# EasyEDA schematic SCH_【Umeko-DEC-H】海曼htpa性价比口袋热成像仪_2025-03-20 (1).json
TITLE: Sheet_1; REV: 1.0; Date: 2025-01-16; Sheet: 1/1; Drawn By: umekoko; Company: Your Company
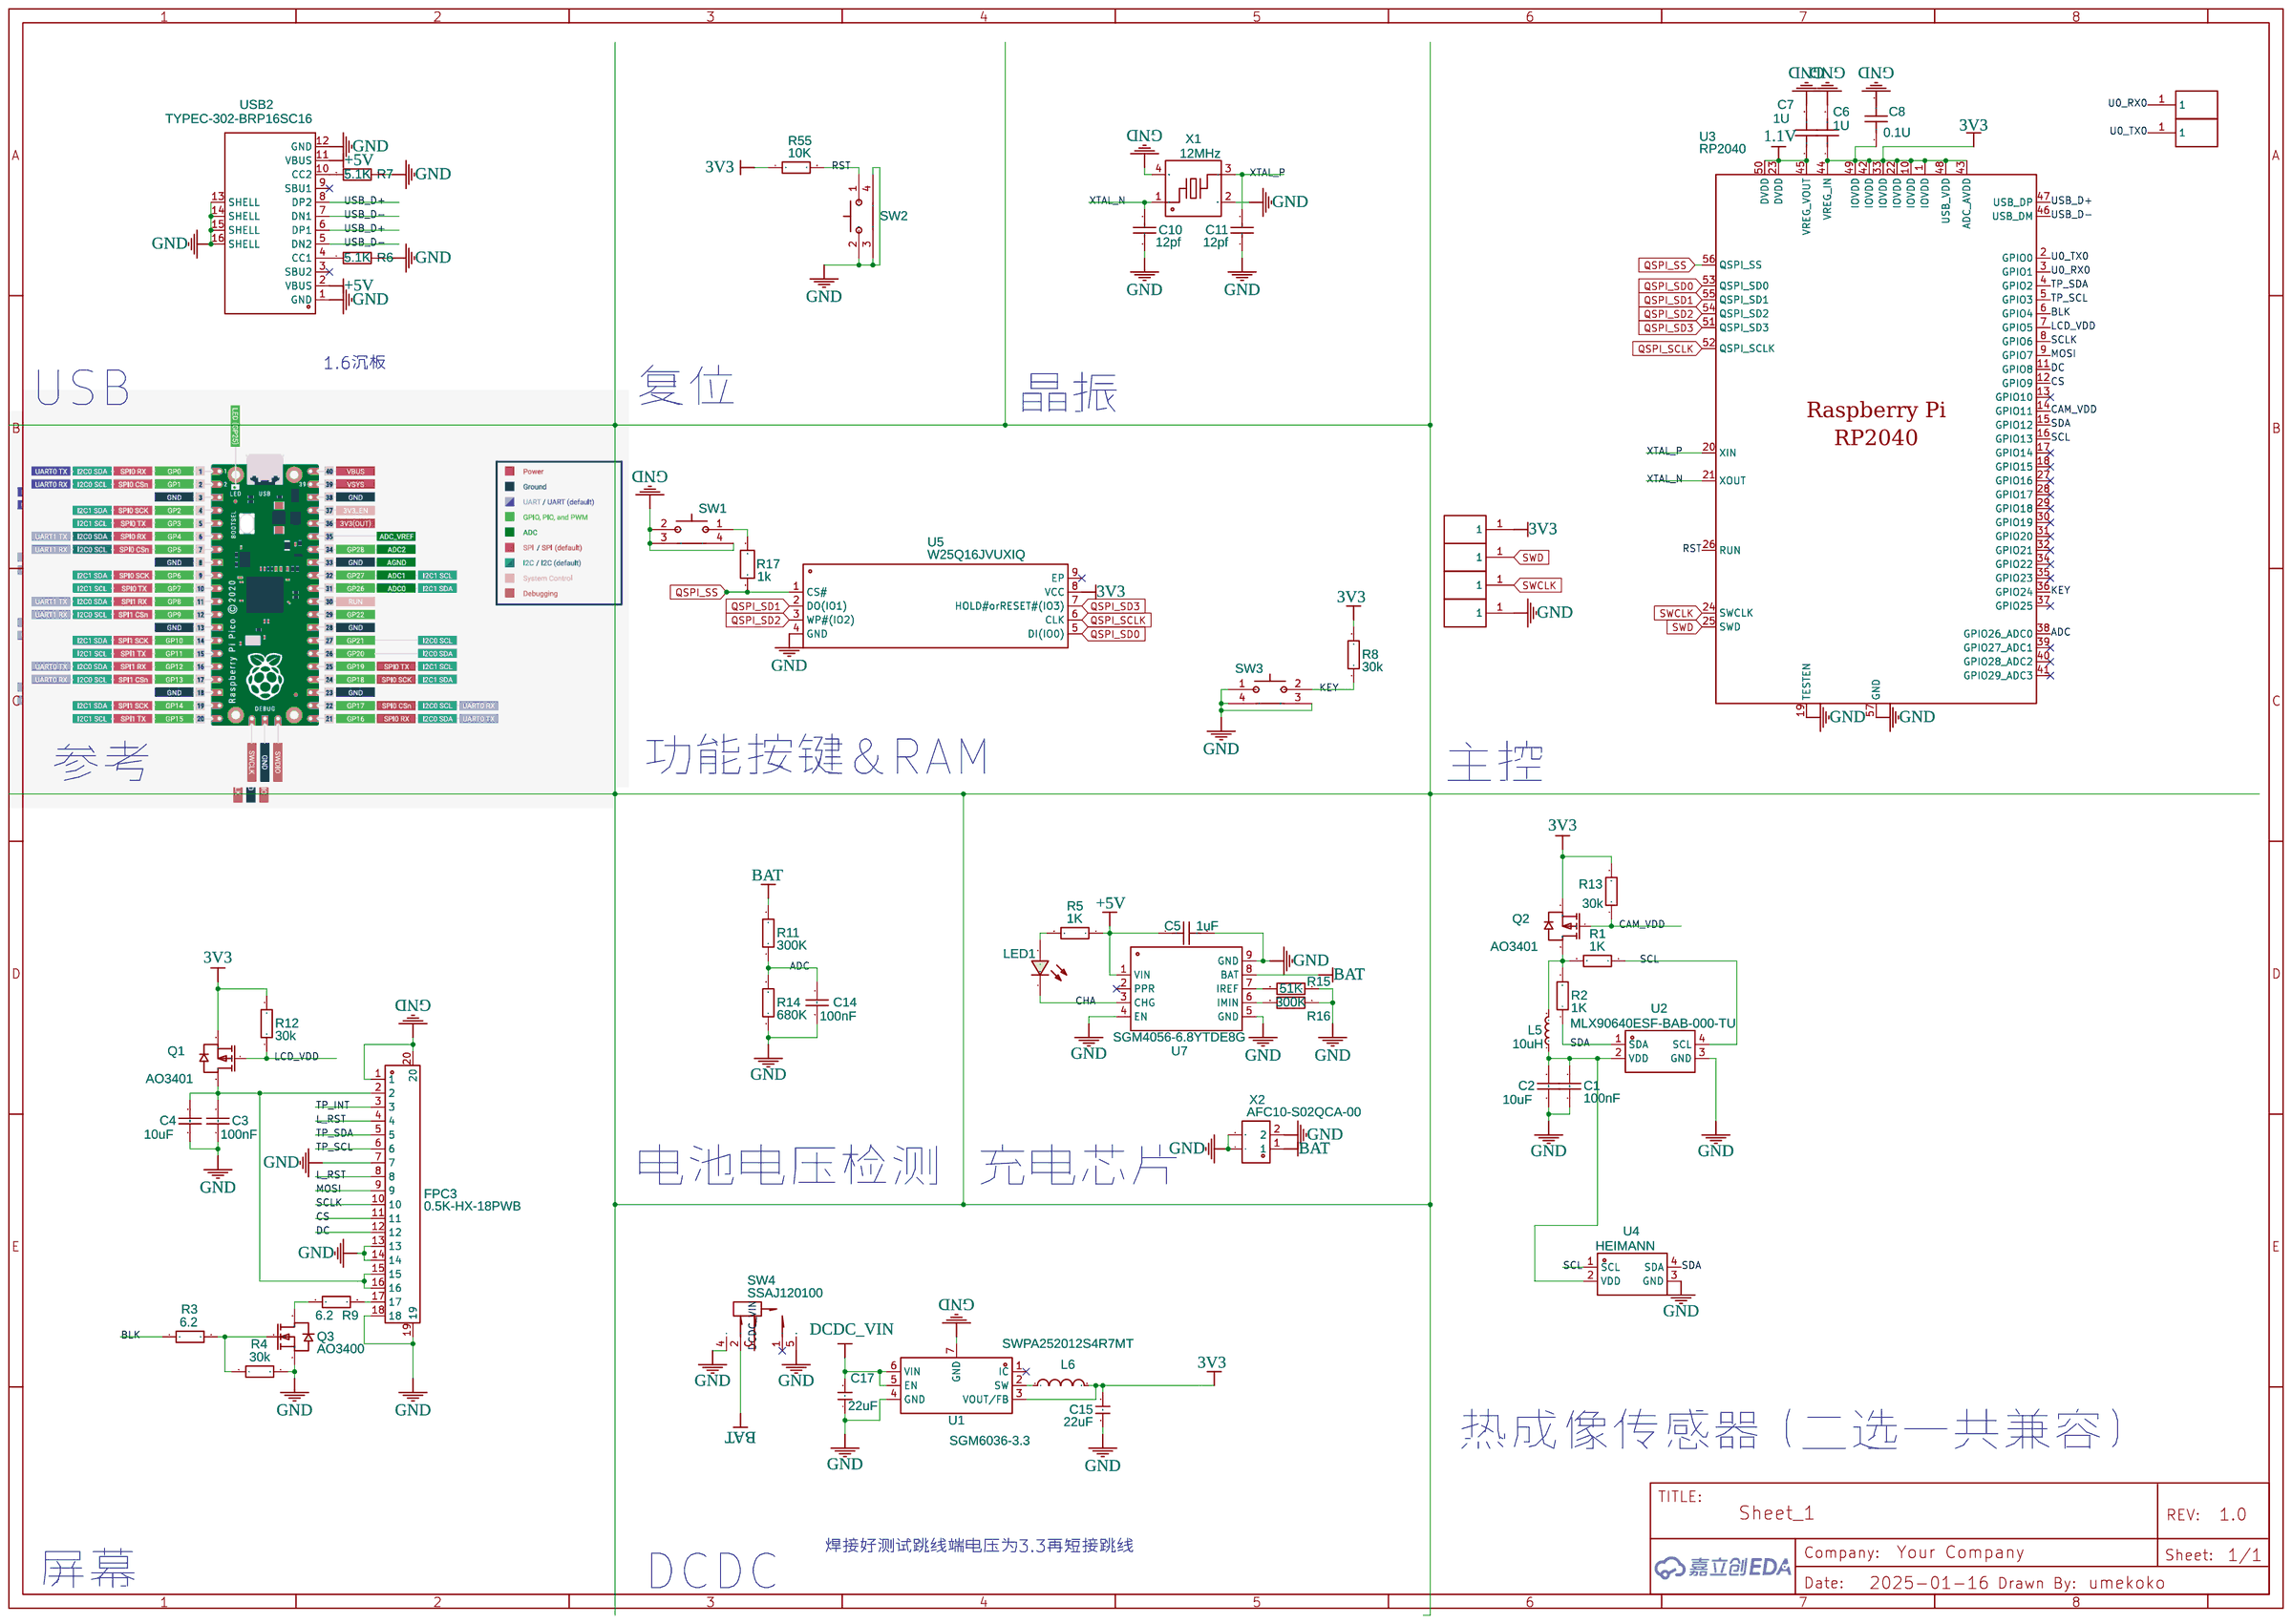
[diagram p0: schematic sheet]

## Parts
C1  100nF  [C0603]
C2  10uF  [C0603]
C3  100nF  [C0603]
C4  10uF  [C0603]
C5  1uF  [C0603]
C6  1U  [C0603]
C7  1U  [C0603]
C8  0.1U  [C0603]
C10  12pf  [C0603]
C11  12pf  [C0603]
C14  100nF  [C0603]
C15  22uF  [C0603]
C17  22uF  [C0603]
FPC3  0.5K-HX-18PWB  [FPC-SMD_18P-P0.50_HDGC_0.5K-HX-18PWB]
H1  hp  [HANPAN]
H2  hp  [HANPAN]
H3  hp  [HANPAN]
H4  hp  [HANPAN]
H5  hp  [HANPAN]
H6  hp  [HANPAN]
L5  10uH  [0805-L]
L6  SWPA252012S4R7MT  [IND-SMD_L2.5-W2.0_SWPA252012S]
LED1  led-0603  [LED-0603]
Q1  AO3401  [SOT-23-3_L2.9-W1.3-P1.90-LS2.4-BR]
Q2  AO3401  [SOT-23-3_L2.9-W1.3-P1.90-LS2.4-BR]
Q3  AO3400  [SOT-23-3_L2.9-W1.4-P1.91-LS2.6-BR]
R1  1K  [R0603]
R2  1K  [R0603]
R3  6.2  [R0603]
R4  30k  [R0603]
R5  1K  [R0603]
R6  5.1K  [R0603]
R7  5.1K  [R0603]
R8  30k  [R0603]
R9  6.2  [R0603]
R11  300K  [R0603]
R12  30k  [R0603]
R13  30k  [R0603]
R14  680K  [R0603]
R15  51K  [R0603]
R16  300K  [R0603]
R17  1k  [R0603]
R55  10K  [R0603]
SW1  1TS003B  [KEY-SMD_1TS003B]
SW2  1TS003B  [KEY-SMD_1TS003B]
SW3  1TS003B  [KEY-SMD_1TS003B]
SW4  SSAJ120100  [SW-SMD_SSAJ120100]
U1  SGM6036-3.3  [UTDFN-6_L2.0-W1.5-P0.50-BL-EP]
U2  MLX90640ESF-BAB-000-TU  [TO-39-4_MELEXIS_MLX90640]
U3  RP2040  [LQFN-56_L7.0-W7.0-P0.4-EP]
U4  HEIMANN  [TO-39-4_MELEXIS_MLX90640]
U5  W25Q16JVUXIQ  [USON-8_L3.0-W2.0-P0.50-BL-EP]
U7  SGM4056-6.8YTDE8G  [TDFN-8L_L2.0-W2.0-P0.50-BL-EP]
USB2  TYPEC-302-BRP16SC16  [USB-C-SMD_TYPEC-302-BRP16SC16]
X1  12MHz  [2016_4P]
X2  AFC10-S02QCA-00  [CONN-SMD_AFC10-S02QCA-00]

## Library data of the parts
C1-C5 C14 C15 C17 = cap 0603: Contributor: dhx233
C6-C8 = C_0603_US: Contributor: LCEDA_Lib
C10 C11 = cap 0402: Contributor: dhx233
FPC3 = 0.5K-HX-18PWB: Contributor: LCSC
H1-H6 = hp: Contributor: WLFPV
L5 = 0805-L: Contributor: 启凡科创
L6 = SWPA252012S2R2N
LED1 = led-0603: Contributor: 启凡科创官方
Q1 Q2 = AO3401_C2848197: Contributor: LCSC; Supplier: LCSC; Supplier Part: C2848197; Manufacturer: IDCHIP(英锐芯); JLCPCB Part Class: Extended Part
Q3 = AO3400_C2848198: Contributor: LCSC; Supplier: LCSC; Supplier Part: C2848198; Manufacturer: IDCHIP(英锐芯); JLCPCB Part Class: Extended Part
R1-R9 R11-R16 R55 = res-0603: Contributor: dhx233
R17 = R_0603_EU: Contributor: LCEDA_Lib
SW1-SW3 = 1TS003B-1900-3500A: Contributor: LCSC
SW4 = SSAJ120100: Supplier: LCSC; Supplier Part: C160864; Manufacturer: ALPSALPINE(阿尔卑斯阿尔派); Contributor: LCSC; JLCPCB Part Class: Extended Part
U1 = SGM6036-ADJYUDT6G/TR: Contributor: lcsc
U2 U4 = MLX90640ESF-BAB-000-TU: Contributor: lcsc
U3 = RP2040: Supplier: LCSC; Supplier Part: C2040; Manufacturer: Raspberry Pi(树莓派); JLCPCB Part Class: Extended Part; Contributor: LCSC
U5 = W25Q16JVUXIQ: Contributor: lcsc; Supplier: LCSC; Supplier Part: C2843335; Manufacturer: WINBOND(华邦); JLCPCB Part Class: Extended Part
U7 = SGM4056-6.8YTDE8G: Contributor: LCSC
USB2 = TYPEC-302-BRP16SC16: Supplier: LCSC; Supplier Part: C2835313; Manufacturer: XUNPU(讯普); Contributor: LCSC
X1 = 2016_4P: Contributor: 启凡科创
X2 = AFC10-S02QCA-00: Contributor: LCSC; Supplier: LCSC; Supplier Part: C2764181; Manufacturer: JS(钜硕电子); JLCPCB Part Class: Extended Part

## Nets
1.1V: C7.1 U3.23(DVDD) U3.45(VREG_VOUT) U3.50(DVDD)
3V3: C6.1 C8.1 C15.2 H3.1 L6.2 Q1.2(S) Q2.2(S) R8.2 R12.2 R13.2 R55.1 U1.3(VOUT/FB) U3.1(IOVDD) U3.10(IOVDD) U3.22(IOVDD) U3.33(IOVDD) U3.42(IOVDD) U3.43(ADC_AVDD) U3.44(VREG_IN) U3.48(USB_VDD) U3.49(IOVDD) U5.8(VCC)
+5V: C5.1 R5.1 U7.1(VIN) USB2.2(VBUS) USB2.11(VBUS)
GND: C1.2 C2.2 C3.2 C4.2 C5.2 C6.2 C7.2 C8.2 C10.2 C11.1 C14.2 C15.1 C17.1 FPC3.1 FPC3.7 FPC3.13 FPC3.14 FPC3.18 FPC3.19 FPC3.20 H4.1 Q3.2(S) R4.2 R6.2 R7.1 R14.1 R15.1 R16.1 SW1.2 SW1.3 SW1.4 SW2.2 SW2.3 SW2.4 SW3.1 SW3.3 SW3.4 SW4.4 SW4.5 U1.4(GND) U1.7(GND) U2.3(GND) U3.19(TESTEN) U3.57(GND) U4.3(GND) U5.4(GND) U7.4(EN) U7.5(GND) U7.9(GND) USB2.1(GND) USB2.12(GND) USB2.13(SHELL) USB2.14(SHELL) USB2.15(SHELL) USB2.16(SHELL) X1.2(GND) X1.4(GND) X2.2 X2.3 X2.4
ADC: C14.1 R11.1 R14.2 U3.38(GPIO26_ADC0)
BAT: R11.2 SW4.2 U7.8(BAT) X2.1
BLK: R3.1 U3.6(GPIO4)
CAM_VDD: Q2.1(G) R13.1 U3.14(GPIO11)
CHA: LED1.1(C) U7.3(CHG)
CS: FPC3.11 U3.12(GPIO9)
DC: FPC3.12 U3.11(GPIO8)
DCDC_VIN: C17.2 SW4.C U1.5(EN) U1.6(VIN)
KEY: R8.1 SW3.2 U3.36(GPIO24)
L_RST: FPC3.4 FPC3.8
LCD_VDD: Q1.1(G) R12.1 U3.7(GPIO5)
MOSI: FPC3.9 U3.9(GPIO7)
QSPI_SCLK: U3.52(QSPI_SCLK) U5.6(CLK)
QSPI_SD0: U3.53(QSPI_SD0) U5.5(DI(IO0))
QSPI_SD1: U3.55(QSPI_SD1) U5.2(DO(IO1))
QSPI_SD2: U3.54(QSPI_SD2) U5.3(WP#(IO2))
QSPI_SD3: U3.51(QSPI_SD3) U5.7(HOLD#orRESET#(IO3))
QSPI_SS: R17.1 U3.56(QSPI_SS) U5.1(CS#)
RST: R55.2 SW2.1 U3.26(RUN)
SCL: R1.1 U2.4(SCL) U3.16(GPIO13) U4.1(SCL)
SCLK: FPC3.10 U3.8(GPIO6)
SDA: R2.1 U2.1(SDA) U3.15(GPIO12) U4.4(SDA)
SWCLK: H6.1 U3.24(SWCLK)
SWD: H5.1 U3.25(SWD)
TP_INT: FPC3.3
TP_SCL: FPC3.6 U3.5(GPIO3)
TP_SDA: FPC3.5 U3.4(GPIO2)
U0_RX0: H1.1 U3.3(GPIO1)
U0_TX0: H2.1 U3.2(GPIO0)
USB_D+: U3.47(USB_DP) USB2.6(DP1) USB2.8(DP2)
USB_D-: U3.46(USB_DM) USB2.5(DN2) USB2.7(DN1)
XTAL_N: C10.1 U3.21(XOUT) X1.1
XTAL_P: C11.2 U3.20(XIN) X1.3
Net-(C1-1): C1.1 C2.1 L5.1 U2.2(VDD) U4.2(VDD)
Net-(C3-1): C3.1 C4.1 FPC3.2 FPC3.15 FPC3.16 Q1.3(D)
Net-(FPC3-17): FPC3.17 R9.2
Net-(L5-2): L5.2 Q2.3(D) R1.2 R2.2
Net-(L6-1): L6.1 U1.2(SW)
Net-(LED1-2): LED1.2(A) R5.2
Net-(Q3-1): Q3.1(G) R3.2 R4.1
Net-(Q3-3): Q3.3(D) R9.1
Net-(R6-1): R6.1 USB2.4(CC1)
Net-(R7-2): R7.2 USB2.10(CC2)
Net-(R15-2): R15.2 U7.7(IREF)
Net-(R16-2): R16.2 U7.6(IMIN)
Net-(R17-2): R17.2 SW1.1

Not connected (* = marked no-connect by the designer): SW4 1*; U1 1(IC)*; U3 13(GPIO10)* 17(GPIO14)* 18(GPIO15)* 27(GPIO16)* 28(GPIO17)* 29(GPIO18)* 30(GPIO19)* 31(GPIO20)* 32(GPIO21)* 34(GPIO22)* 35(GPIO23)* 37(GPIO25)* 39(GPIO27_ADC1)* 40(GPIO28_ADC2)* 41(GPIO29_ADC3)*; U5 9(EP)*; U7 2(PPR)*; USB2 3(SBU2)* 9(SBU1)*

## Notes on the sheet
- 1.6沉板
- USB
- 复位
- 晶振
- 功能按键&RAM
- 参考
- 主控
- 电池电压检测
- 充电芯片
- 热成像传感器（二选一共兼容）
- 焊接好测试跳线端电压为3.3再短接跳线
- 屏幕
- DCDC
